# EAGLE design FabDisPendant (EAGLE 7.4.0)
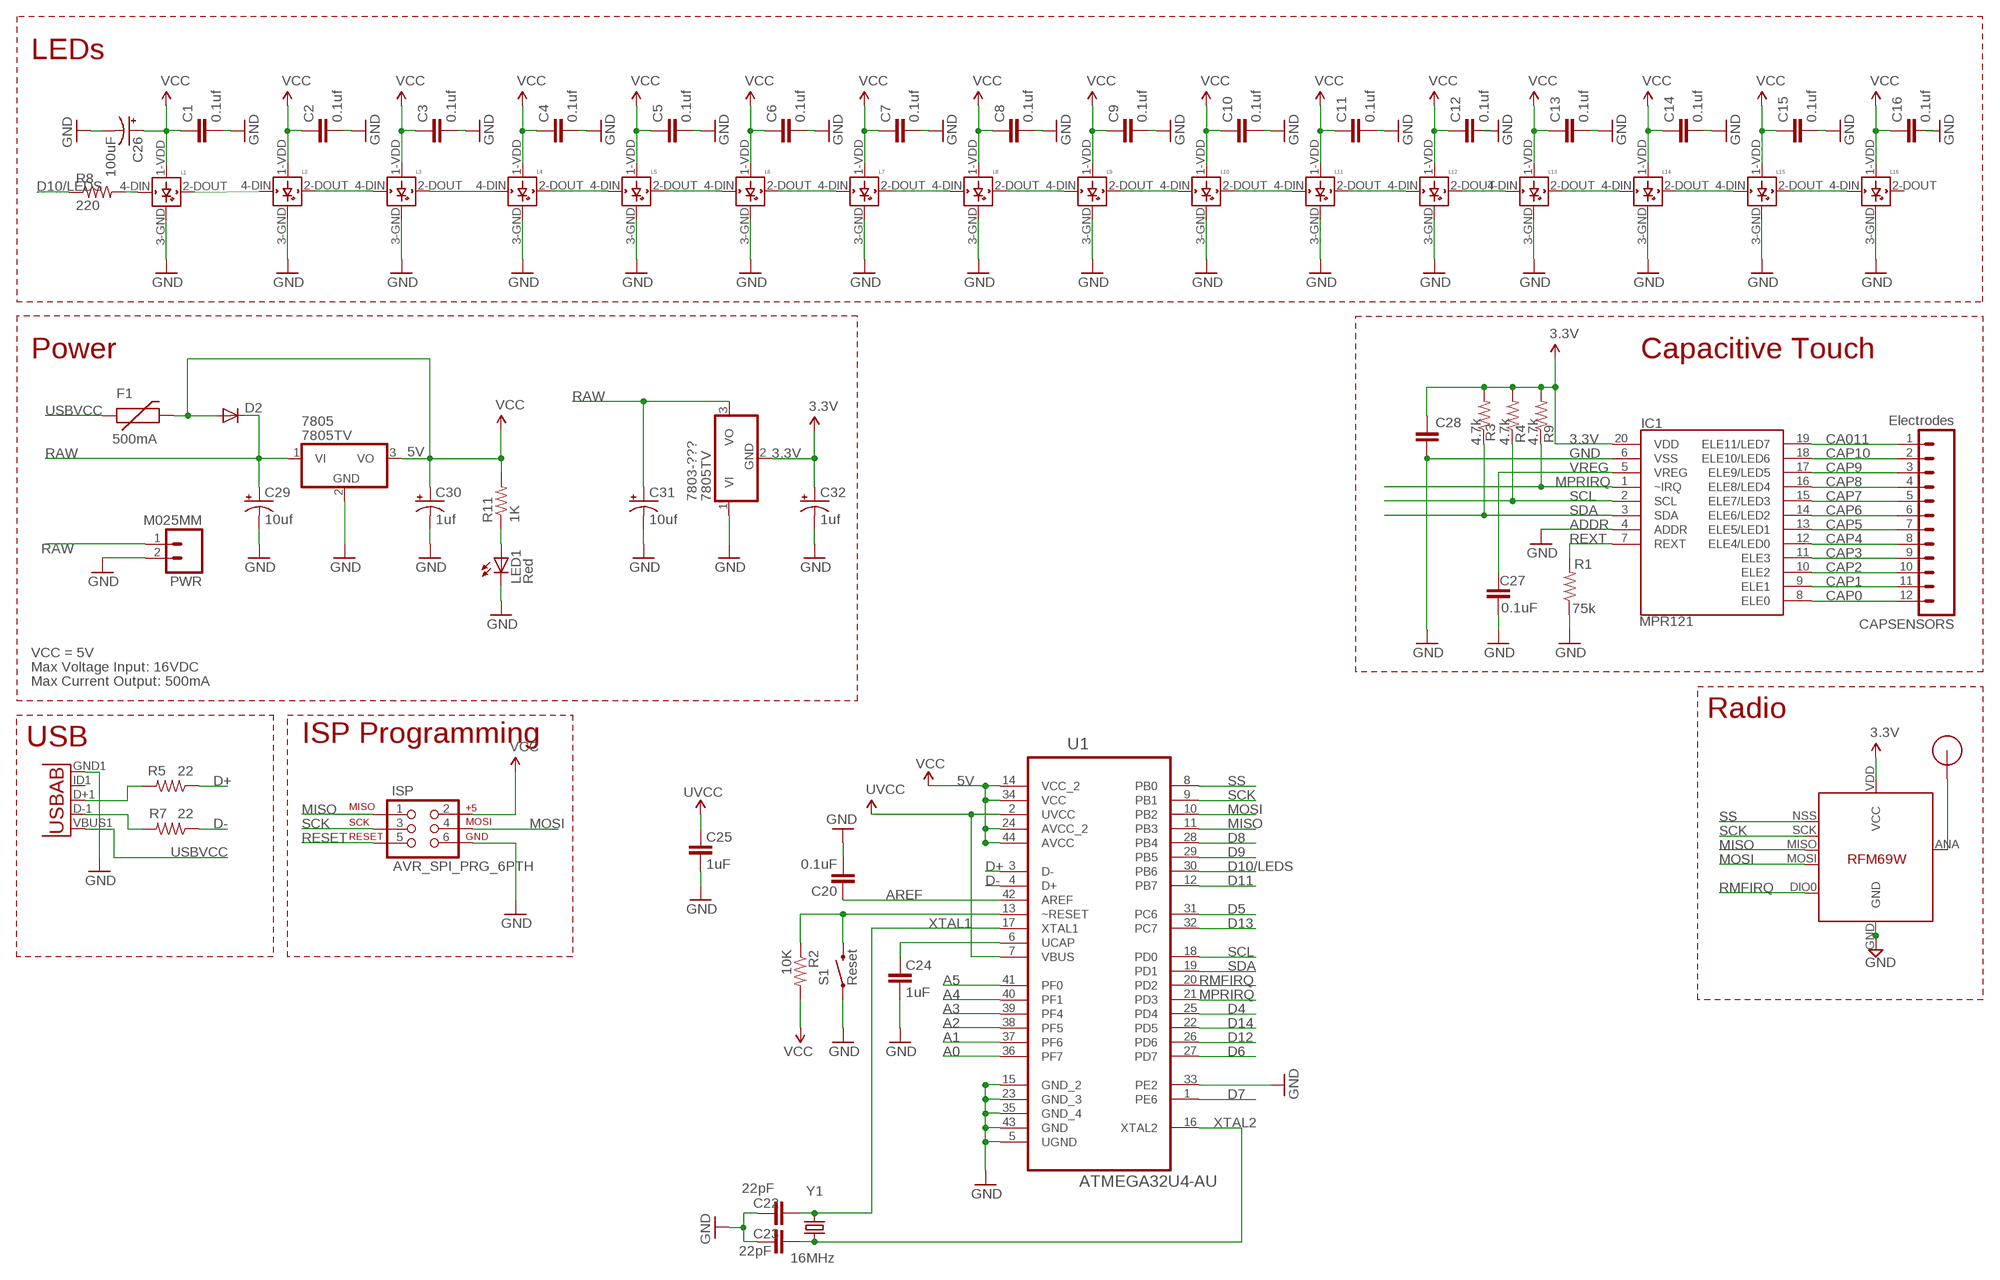
[diagram p0: schematic, sheet 1]

## Parts
7803-???  7805TV  [TO220V]
7805  7805TV  [TO220V]
C1  0.1uf  CAP0603-CAP  [0603-CAP]
C2  0.1uf  CAP0603-CAP  [0603-CAP]
C3  0.1uf  CAP0603-CAP  [0603-CAP]
C4  0.1uf  CAP0603-CAP  [0603-CAP]
C5  0.1uf  CAP0603-CAP  [0603-CAP]
C6  0.1uf  CAP0603-CAP  [0603-CAP]
C7  0.1uf  CAP0603-CAP  [0603-CAP]
C8  0.1uf  CAP0603-CAP  [0603-CAP]
C9  0.1uf  CAP0603-CAP  [0603-CAP]
C10  0.1uf  CAP0603-CAP  [0603-CAP]
C11  0.1uf  CAP0603-CAP  [0603-CAP]
C12  0.1uf  CAP0603-CAP  [0603-CAP]
C13  0.1uf  CAP0603-CAP  [0603-CAP]
C14  0.1uf  CAP0603-CAP  [0603-CAP]
C15  0.1uf  CAP0603-CAP  [0603-CAP]
C16  0.1uf  CAP0603-CAP  [0603-CAP]
C20  0.1uF  CAP0603-CAP  [0603-CAP]
C22  22pF  CAP0603-CAP  [0603-CAP]
C23  22pF  CAP0603-CAP  [0603-CAP]
C24  1uF  CAP0603-CAP  [0603-CAP]
C25  1uF  CAP0603-CAP  [0603-CAP]
C26  100uF  100UF-63V-20%(ELECT)  [NIC_10X10.5_CAP]
C27  0.1uF  CAP0603-CAP  [0603-CAP]
C28  0.1uF  CAP0603-CAP  [0603-CAP]
C29  10uf  CAP_POLPTH2  [CPOL-RADIAL-10UF-25V]
C30  1uf  CAP_POLPTH2  [CPOL-RADIAL-10UF-25V]
C31  10uf  CAP_POLPTH2  [CPOL-RADIAL-10UF-25V]
C32  1uf  CAP_POLPTH2  [CPOL-RADIAL-10UF-25V]
CAPSENSORS  Electrodes  M12PTH  [1X12]
D2  DIODESOD  [SOD-323]
F1  500mA  PTCSMD  [PTC-1206]
IC1  MPR121  MPR121V2  [QFN-20-0.4MM-V2]
ISP  AVR_SPI_PRG_6PTH  [2X3]
L1  WS2812B  [WS2812B]
L2  WS2812B  [WS2812B]
L3  WS2812B  [WS2812B]
L4  WS2812B  [WS2812B]
L5  WS2812B  [WS2812B]
L6  WS2812B  [WS2812B]
L7  WS2812B  [WS2812B]
L8  WS2812B  [WS2812B]
L9  WS2812B  [WS2812B]
L10  WS2812B  [WS2812B]
L11  WS2812B  [WS2812B]
L12  WS2812B  [WS2812B]
L13  WS2812B  [WS2812B]
L14  WS2812B  [WS2812B]
L15  WS2812B  [WS2812B]
L16  WS2812B  [WS2812B]
LED1  Red  LED0603  [LED-0603]
PWR  M025MM  [SCREWTERMINAL-5MM-2]
R1  75k  RESISTOR0603-RES  [0603-RES]
R2  10K  RESISTOR0603-RES  [0603-RES]
R3  4.7k  RESISTOR0603-RES  [0603-RES]
R4  4.7k  RESISTOR0603-RES  [0603-RES]
R5  22  RESISTOR0603-RES  [0603-RES]
R7  22  RESISTOR0603-RES  [0603-RES]
R8  220  220OHM-1/10W-1%(0603)  [0603-RES@1]
R9  4.7k  RESISTOR0603-RES  [0603-RES]
R11  1K  RESISTOR0603-RES  [0603-RES]
RMF69  RFM69  [RFM69W-MINPADS]
S1  Reset  SWITCH-MOMENTARY-2SMD  [TACTILE_SWITCH_SMD]
U1  ATMEGA32U4-AU  [QFP80P1200X1200X120-44N]
U$1  RFM12B_ANTENNA  [RFM12B-ANTENNA]
X2  USB-ABIN&OUT  [USB-AB-MICRO-SMD-V03-IN&OUT]
Y1  16MHz  CRYSTAL5X3  [CRYSTAL-SMD-5X3]

## Nets
3.3V: 7803-???.2(GND) C28.1 C32.1(+) IC1.20(VDD) R3.2 R4.2 R9.2 RMF69.VDD(VCC)
5V: 7805.3(VO) C1.1 C2.1 C3.1 C4.1 C5.1 C6.1 C7.1 C8.1 C9.1 C10.1 C11.1 C12.1 C13.1 C14.1 C15.1 C16.1 C26.+ C30.1(+) D2.2(A) F1.2 ISP.2 L1.1-VDD(VDD) L2.1-VDD(VDD) L3.1-VDD(VDD) L4.1-VDD(VDD) L5.1-VDD(VDD) L6.1-VDD(VDD) L7.1-VDD(VDD) L8.1-VDD(VDD) L9.1-VDD(VDD) L10.1-VDD(VDD) L11.1-VDD(VDD) L12.1-VDD(VDD) L13.1-VDD(VDD) L14.1-VDD(VDD) L15.1-VDD(VDD) L16.1-VDD(VDD) R2.2 R11.2 U1.14(VCC_2) U1.24(AVCC_2) U1.34(VCC) U1.44(AVCC) ; supply symbol labelled VCC
A0: U1.36(PF7)
A1: U1.37(PF6)
A2: U1.38(PF5)
A3: U1.39(PF4)
A4: U1.40(PF1)
A5: U1.41(PF0)
ADDR: IC1.4(ADDR) ; supply symbol labelled GND
AREF: C20.2 U1.42(AREF)
CA011: CAPSENSORS.1 IC1.19(ELE11/LED7)
CAP0: CAPSENSORS.12 IC1.8(ELE0)
CAP1: CAPSENSORS.11 IC1.9(ELE1)
CAP2: CAPSENSORS.10 IC1.10(ELE2)
CAP3: CAPSENSORS.9 IC1.11(ELE3)
CAP4: CAPSENSORS.8 IC1.12(ELE4/LED0)
CAP5: CAPSENSORS.7 IC1.13(ELE5/LED1)
CAP6: CAPSENSORS.6 IC1.14(ELE6/LED2)
CAP7: CAPSENSORS.5 IC1.15(ELE7/LED3)
CAP8: CAPSENSORS.4 IC1.16(ELE8/LED4)
CAP9: CAPSENSORS.3 IC1.17(ELE9/LED5)
CAP10: CAPSENSORS.2 IC1.18(ELE10/LED6)
D4: U1.25(PD4)
D5: U1.31(PC6)
D6: U1.27(PD7)
D7: U1.1(PE6)
D8: U1.28(PB4)
D9: U1.29(PB5)
D10/LEDS: R8.1 U1.30(PB6)
D11: U1.12(PB7)
D12: U1.26(PD6)
D13: U1.32(PC7)
D14: U1.22(PD5)
D+: R5.1 U1.3(D-)
D-: R7.1 U1.4(D+)
GND: 7803-???.1(VI) 7805.2(GND) C1.2 C2.2 C3.2 C4.2 C5.2 C6.2 C7.2 C8.2 C9.2 C10.2 C11.2 C12.2 C13.2 C14.2 C15.2 C16.2 C20.1 C22.2 C23.2 C24.1 C25.1 C26.- C27.2 C28.2 C29.2(-) C30.2(-) C31.2(-) C32.2(-) IC1.6(VSS) ISP.6 L1.3-GND(GND) L2.3-GND(GND) L3.3-GND(GND) L4.3-GND(GND) L5.3-GND(GND) L6.3-GND(GND) L7.3-GND(GND) L8.3-GND(GND) L9.3-GND(GND) L10.3-GND(GND) L11.3-GND(GND) L12.3-GND(GND) L13.3-GND(GND) L14.3-GND(GND) L15.3-GND(GND) L16.3-GND(GND) LED1.C PWR.2 R1.1 RMF69.GND S1.1 U1.5(UGND) U1.15(GND_2) U1.23(GND_3) U1.33(PE2) U1.35(GND_4) U1.43(GND) X2.GND1(GND)
MISO: ISP.1 RMF69.MISO U1.11(PB3)
MOSI: ISP.4 RMF69.MOSI U1.10(PB2)
MPRIRQ: IC1.1(~IRQ) R9.1 U1.21(PD3)
N$1: L1.4-DIN(DIN) R8.2
N$2: L1.2-DOUT(DOUT) L2.4-DIN(DIN)
N$3: L2.2-DOUT(DOUT) L3.4-DIN(DIN)
N$4: L3.2-DOUT(DOUT) L4.4-DIN(DIN)
N$5: L5.2-DOUT(DOUT) L6.4-DIN(DIN)
N$6: L6.2-DOUT(DOUT) L7.4-DIN(DIN)
N$7: L7.2-DOUT(DOUT) L8.4-DIN(DIN)
N$8: L9.2-DOUT(DOUT) L10.4-DIN(DIN)
N$9: L10.2-DOUT(DOUT) L11.4-DIN(DIN)
N$10: L11.2-DOUT(DOUT) L12.4-DIN(DIN)
N$11: L8.2-DOUT(DOUT) L9.4-DIN(DIN)
N$12: L4.2-DOUT(DOUT) L5.4-DIN(DIN)
N$13: L13.2-DOUT(DOUT) L14.4-DIN(DIN)
N$14: L14.2-DOUT(DOUT) L15.4-DIN(DIN)
N$15: L15.2-DOUT(DOUT) L16.4-DIN(DIN)
N$16: L12.2-DOUT(DOUT) L13.4-DIN(DIN)
N$20: R7.2 X2.D-1(D-)
N$21: R5.2 X2.D+1(D+)
N$25: RMF69.ANA(ANT) U$1.P$1
N$38: LED1.A R11.1
N$55: C24.2 U1.6(UCAP)
RAW [vcc]: 7803-???.3(VO) 7805.1(VI) C29.1(+) C31.1(+) D2.1(C) PWR.1
RESET: ISP.5 R2.1 S1.3 U1.13(~RESET)
REXT: IC1.7(REXT) R1.2
RMFIRQ: RMF69.DIO0 U1.20(PD2)
SCK: ISP.3 RMF69.SCK U1.9(PB1)
SCL: IC1.2(SCL) R4.1 U1.18(PD0)
SDA: IC1.3(SDA) R3.1 U1.19(PD1)
SS: RMF69.NSS(SEL) U1.8(PB0)
USBVCC: C25.2 F1.1 U1.2(UVCC) U1.7(VBUS) X2.VBUS1(VBUS) ; supply symbol labelled UVCC
VREG: C27.1 IC1.5(VREG)
XTAL1: C22.1 U1.17(XTAL1) Y1.3
XTAL2: C23.1 U1.16(XTAL2) Y1.1
Unconnected: L16.2-DOUT(DOUT) X2.ID1(USBID)

## Notes on the sheet
- LEDs
- Power | Capacitive Touch
- VCC = 5V
- Max Voltage Input: 16VDC
- Max Current Output: 500mA
- Radio
- USB | ISP Programming

## Library data of the parts
7803-??? 7805 = linear:78*: Positive VOLTAGE REGULATOR Source: http://cache.national.com/ds/LM/LM78L05.pdf http://www.fairchildsemi.com/ds/LM/LM7805.pdf
C1-C16 = SparkFun-Capacitors:CAP: Capacitor Standard 0603 ceramic capacitor, and 0.1" leaded capacitor.
C20 C22-C25 C27 C28 = SparkFun:CAP: Capacitor Standard 0603 ceramic capacitor, and 0.1" leaded capacitor.
C26 = SparkFun-Capacitors:100UF-63V-20%(ELECT): CAP-08362 100uF electrolytic SMT 63V 20%; PROD_ID: CAP-08362
C29-C32 = SparkFun-Capacitors:CAP_POL: Capacitor Polarized These are standard SMD and PTH capacitors. Normally 10uF, 47uF, and 100uF in electrolytic and tantalum varieties. Always verify the external diameter of the through hole cap, it varies with capacity, voltage, and manufacturer. The EIA devices should be standard.
CAPSENSORS = SparkFun:M12: Header 12 Standard 12-pin 0.1" header. Use with straight break away headers (SKU : PRT-00116), right angle break away headers (PRT-00553), swiss pins (PRT-00743), machine pins (PRT-00117), and female headers (PRT-00115).
D2 = SparkFun:DIODE: Diode These are standard reverse protection diodes and small signal diodes. SMA package can handle up to about 1A. SOD-323 can handle about 200mA. What the SOD-323 package when ordering, there are some mfgs out there that are 5-pin packages.
F1 = SparkFun:PTC: Resettable Fuse PTC Resettable Fuse. Spark Fun Electronics SKU : COM-08357
IC1 = Testing:MPR121: MPR121 Capacitive Touch Sensor Controller. Variant "V2" was created using an image import of the bottom of the IC. It matches metal to metal.
ISP = SparkFun-Connectors:AVR_SPI_PRG_6: AVR ISP 6 Pin This is the reduced ISP connector for AVR programming. Common on Arduino. This footprint will take up less PCB space and can be used with a 10-pin to 6-pin adapter such as SKU: BOB-08508
L1-L16 = adafruit:WS2812B
LED1 = SparkFun:LED: LEDs Standard schematic elements and footprints for 5mm, 3mm, 1206, and 0603 sized LEDs. 5mm - Spark Fun Electronics SKU : COM-00529 (and others)
PWR = SparkFun-Connectors:M02: Standard 2-pin 0.1" header. Use with - straight break away headers ( PRT-00116) - right angle break away headers (PRT-00553) - swiss pins (PRT-00743) - machine pins (PRT-00117) - female headers (PRT-00115) Molex polarized connector foot print use with: PRT-08233 with associated crimp pins and housings. 2.54_SCREWTERM for use with PRT-10571. 3.5mm Screw Terminal footprints for PRT-08084 5mm Screw Terminal footprints for use with PRT-08433
R1-R5 R7 R9 R11 = SparkFun:RESISTOR: Resistor Basic schematic elements and footprints for 0603, 1206, and PTH 1/10th watt (small) resistors.
R8 = SparkFun-Resistors:220OHM-1/10W-1%(0603): RES-07861; PROD_ID: RES-07861
RMF69 = LowPowerLab:RFM69
S1 = SparkFun:SWITCH-MOMENTARY-2
U1 = Atmel_By_element14_Batch_1-00:ATMEGA32U4-AU: 8-bit Microcontroller with ISP Flash and USB Controller; MPN: ATMEGA32U4-AU; OC_FARNELL: 1748525; OC_NEWARK: 26R5633; PACKAGE: TQFP-44; SUPPLIER: Atmel
U$1 = LowPowerLab:RFM12B_ANTENNA
X2 = Testing:USB-AB: This is a USB AB connector that is compatible with USB OTG. i.e. this connector can serve as a host or device
Y1 = SparkFun:CRYSTAL: Crystals Various standard crystals. Proven footprints. Spark Fun Electronics SKU : COM-00534

## Net classes
0 default: width 0.203 mm

## Board
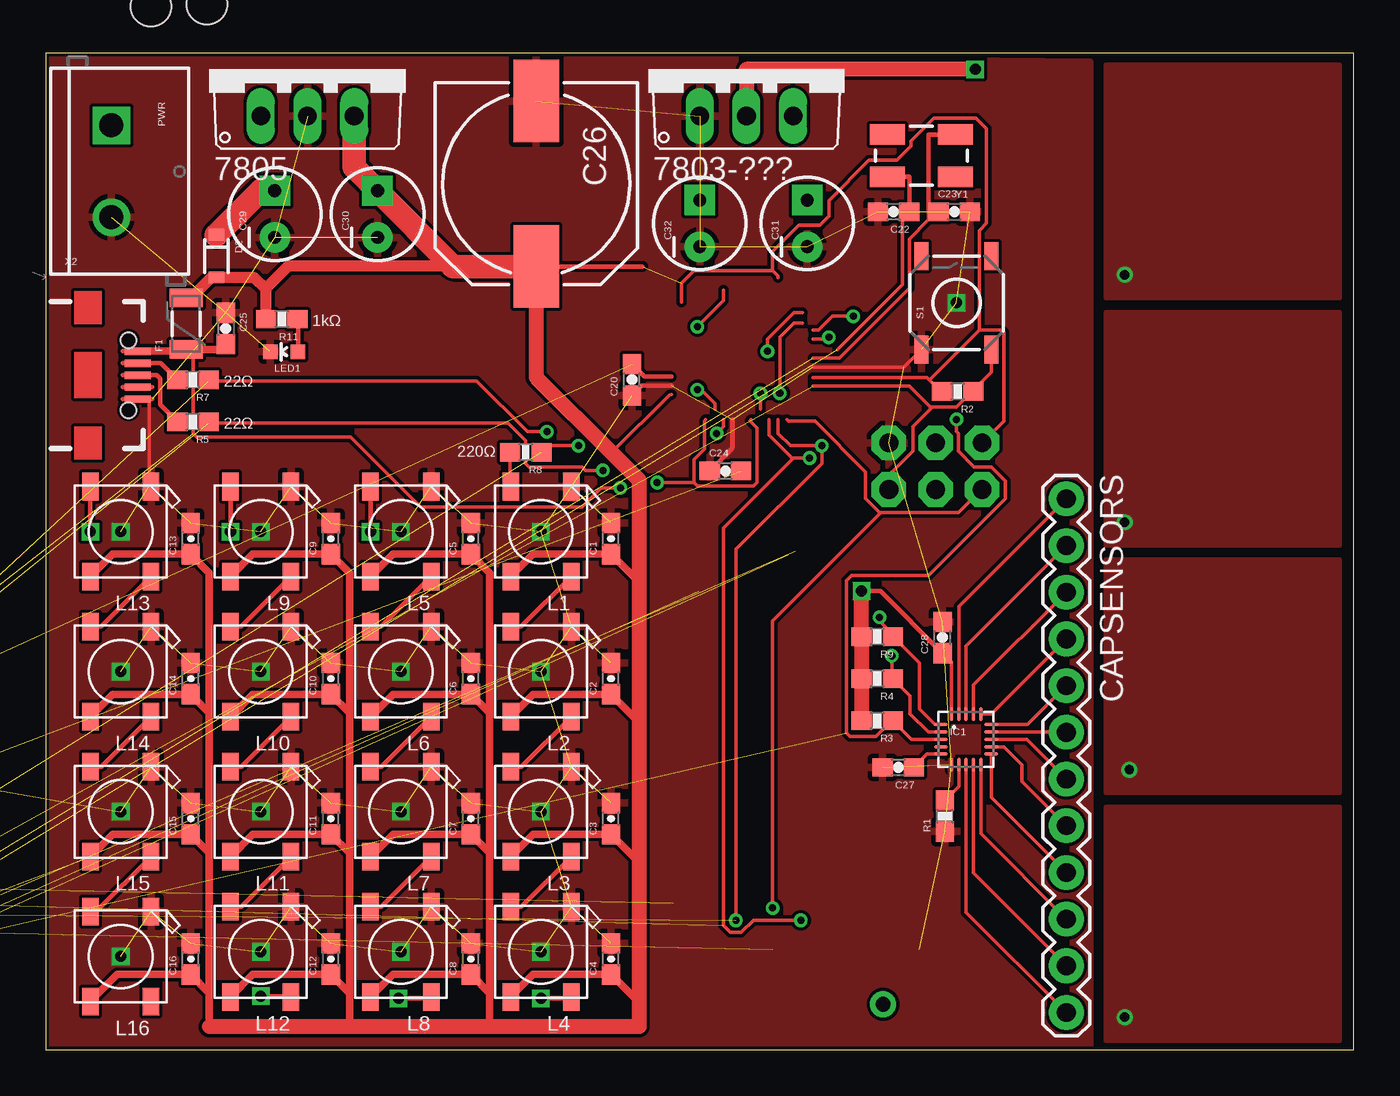
[diagram p1: board, top side]
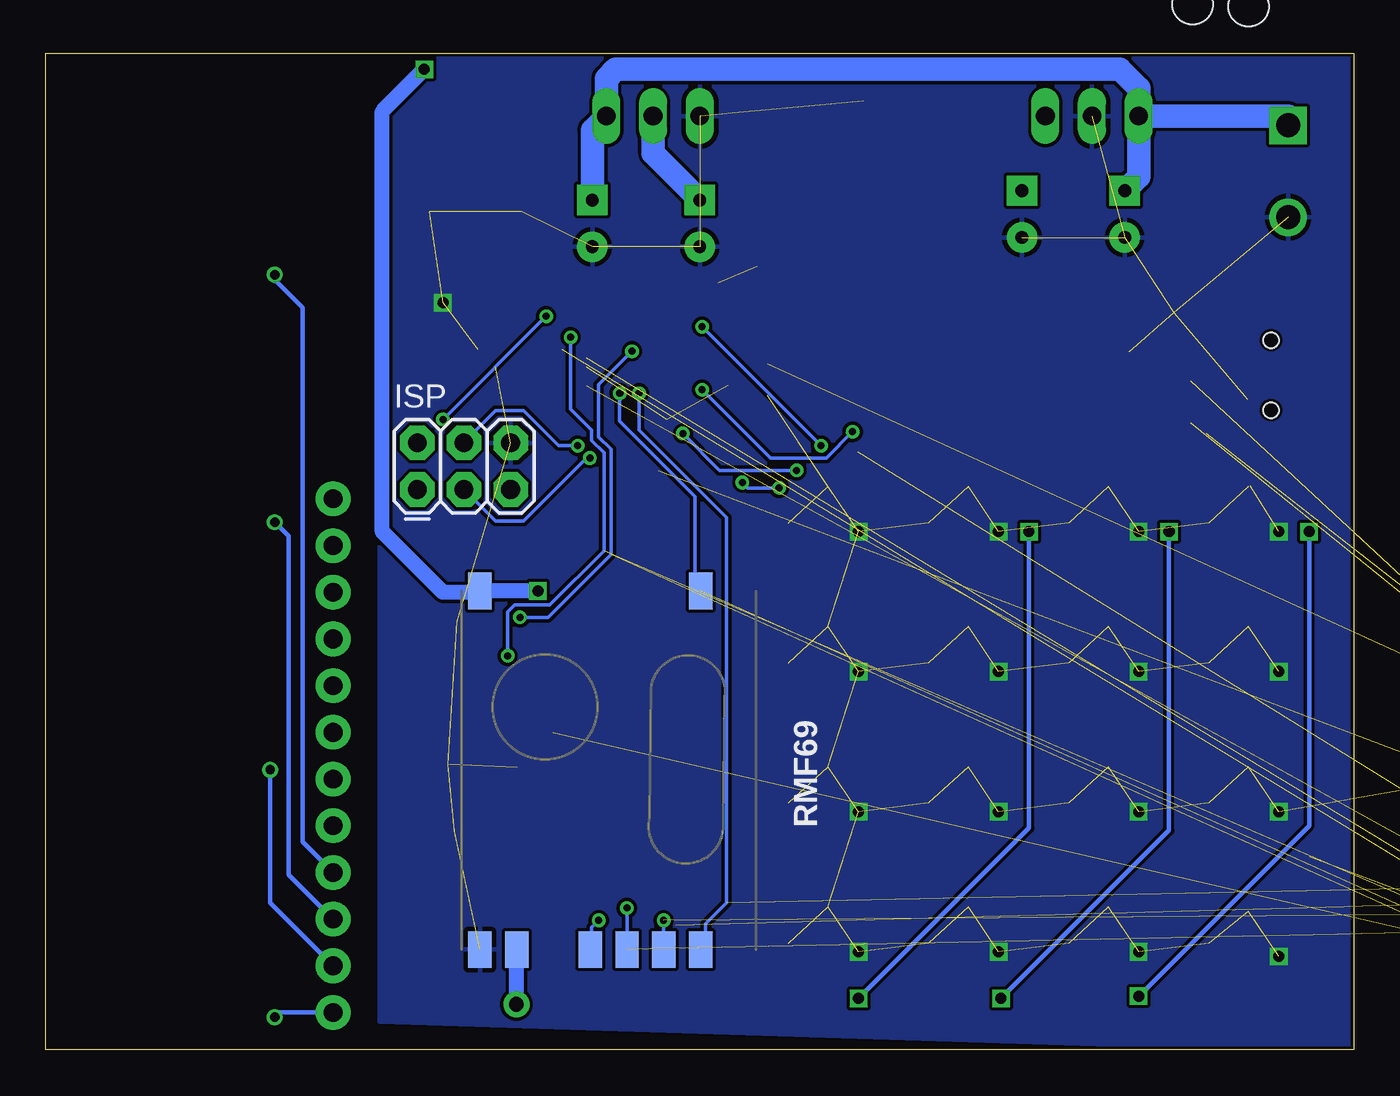
[diagram p2: board, bottom side, seen from below]

Size 71.12 x 54.22 mm. Coordinates in mm from the lower left corner, seen from the top.
Outline: 0,0 71.12,0 71.12,54.22 0,54.22 0,0
Copper layers (1*16): Top 0.035mm / dielectric 1.5mm / Bottom 0.035mm
Design rules "SparkFun-2-layer-TIGHT": minimum track width 7mil, minimum drill 15mil, track to track 7mil, track to pad 7mil, pad to pad 7mil, via to via 7mil, smd to smd 7mil, copper to edge 7mil, drill to drill 7mil, minimum pad ring 7mil, minimum via ring 7mil, stop-mask expansion 4mil, vias tented up to drill 20mil, thermal gap 10mil
Holes 2.2 mm at 5.71,56.77 8.76,56.9

### Footprints (pad centres in the part's own frame; a part is rotated, then mirrored left to right if it is on the bottom)
TO220V = drill 1.016 long: 1 -2.54,-2.54; 2 0,-2.54; 3 2.54,-2.54
0603-CAP = smd 1.1 x 1: 1 -0.85,0; 2 0.85,0
NIC_10X10.5_CAP = smd 4.5 x 2.5: + 4.5,0; - -4.5,0
CPOL-RADIAL-10UF-25V = drill 0.7 pad 1.651 square: 1 1.27,0 | drill 0.7 pad 1.651: 2 -1.27,0
1X12 = drill 1.016 pad 1.88: 1 0,0; 2 2.54,0; 3 5.08,0; 4 7.62,0; 5 10.16,0; 6 12.7,0; 7 15.24,0; 8 17.78,0; 9 20.32,0; 10 22.86,0; 11 25.4,0; 12 27.94,0
SOD-323 = smd 0.63 x 0.83: 1 -1.15,0; 2 1.15,0
PTC-1206 = smd 1 x 1.8: 1 -1.4,0; 2 1.4,0
QFN-20-0.4MM-V2 = smd 0.75 x 0.195: 1 -1.367,0.8; 2 -1.367,0.4; 3 -1.367,0; 4 -1.367,-0.4; 5 -1.367,-0.8; 11 1.375,-0.8; 12 1.375,-0.4; 13 1.375,0; 14 1.375,0.4; 15 1.375,0.8 | smd 0.195 x 0.75: 6 -0.795,-1.372; 7 -0.395,-1.372; 8 0.005,-1.372; 9 0.405,-1.372; 10 0.805,-1.372; 16 0.81,1.372; 17 0.41,1.372; 18 0.01,1.372; 19 -0.39,1.372; 20 -0.79,1.372
2X3 = drill 1.016 pad 1.88 octagon: 1 0,0; 2 0,2.54; 3 2.54,0; 4 2.54,2.54; 5 5.08,0; 6 5.08,2.54
WS2812B = smd 1.5 x 0.9: 1-VDD 2.45,-1.65; 2-DOUT 2.45,1.65; 3-GND -2.45,1.65; 4-DIN -2.45,-1.65
LED-0603 = smd 0.8 x 0.8: A 0,-0.75; C 0,0.75
SCREWTERMINAL-5MM-2 = drill 1.3 pad 2.032 square: 1 0,0 | drill 1.3 pad 2.032: 2 5,0
0603-RES = smd 1.1 x 1: 1 -0.85,0; 2 0.85,0
0603-RES@1 = smd 1.1 x 1: 1 -0.85,0; 2 0.85,0
RFM69W-MINPADS = smd 2 x 1.27: ANA 8,-5; DIO0 -11.5,5; GND 8,-7; MISO 8,1; MOSI 8,3; NSS 8,5; SCK 8,-1; VDD -11.5,-7
TACTILE_SWITCH_SMD = smd 1.524 x 0.762: 1 -2.54,1.905; 2 2.54,1.905; 3 -2.54,-1.905; 4 2.54,-1.905
QFP80P1200X1200X120-44N = smd 1.473 x 0.508: 1 -5.74,3.988; 2 -5.74,3.2; 3 -5.74,2.388; 4 -5.74,1.6; 5 -5.74,0.787; 6 -5.74,0; 7 -5.74,-0.787; 8 -5.74,-1.6; 9 -5.74,-2.388; 10 -5.74,-3.2; 11 -5.74,-3.988; 23 5.74,-3.988; 24 5.74,-3.2; 25 5.74,-2.388; 26 5.74,-1.6; 27 5.74,-0.787; 28 5.74,0; 29 5.74,0.787; 30 5.74,1.6; 31 5.74,2.388; 32 5.74,3.2; 33 5.74,3.988 | smd 0.508 x 1.473: 12 -3.988,-5.74; 13 -3.2,-5.74; 14 -2.388,-5.74; 15 -1.6,-5.74; 16 -0.787,-5.74; 17 0,-5.74; 18 0.787,-5.74; 19 1.6,-5.74; 20 2.388,-5.74; 21 3.2,-5.74; 22 3.988,-5.74; 34 3.988,5.74; 35 3.2,5.74; 36 2.388,5.74; 37 1.6,5.74; 38 0.787,5.74; 39 0,5.74; 40 -0.787,5.74; 41 -1.6,5.74; 42 -2.388,5.74; 43 -3.2,5.74; 44 -3.988,5.74
RFM12B-ANTENNA = drill 0.8 pad 1.422: P$1 0,0
USB-AB-MICRO-SMD-V03-IN&OUT = smd 1.4 x 0.4: D+1 2.7,0; D-1 2.7,0.65; GND1 2.7,-1.3; ID1 2.7,-0.65; VBUS1 2.7,1.3 | hole 0.85: 2.2,1.9; 2.2,-1.9
CRYSTAL-SMD-5X3 = smd 1.9 x 1.1: 1 -1.85,-1.15; 2 1.85,-1.15; 3 1.85,1.15; 4 -1.85,1.15

### Placement (x,y rotation side)
7803-???  38.1,53.34 0 top
7805  14.22,53.34 0 top
C1  30.73,27.81 90 top
C2  30.73,20.19 90 top
C3  30.73,12.57 90 top
C4  30.73,4.95 90 top
C5  23.11,27.81 90 top
C6  23.11,20.19 90 top
C7  23.11,12.57 90 top
C8  23.11,4.95 90 top
C9  15.49,27.81 90 top
C10  15.49,20.19 90 top
C11  15.49,12.57 90 top
C12  15.49,4.95 90 top
C13  7.87,27.81 90 top
C14  7.87,20.19 90 top
C15  7.87,12.57 90 top
C16  7.87,4.95 90 top
C20  31.88,36.45 90 top
C22  46.1,45.59 180 top
C23  49.4,45.59 0 top
C24  36.96,31.5 0 top
C25  9.78,39.24 270 top
C26  26.67,47.12 270 top
C27  46.35,15.37 180 top
C28  48.77,22.43 90 top
C29  12.45,45.47 90 top
C30  18.03,45.47 90 top
C31  41.4,44.96 90 top
C32  35.56,44.96 90 top
CAPSENSORS  55.5,29.97 270 top
D2  9.27,43.18 270 top
F1  7.62,39.5 90 top
IC1  50.04,16.89 0 top
ISP  50.93,30.48 0 bottom
L1  26.92,28.19 270 top
L2  26.92,20.57 270 top
L3  26.92,12.95 270 top
L4  26.92,5.33 270 top
L5  19.3,28.19 270 top
L6  19.3,20.57 270 top
L7  19.3,12.95 270 top
L8  19.3,5.33 270 top
L9  11.68,28.19 270 top
L10  11.68,20.57 270 top
L11  11.68,12.95 270 top
L12  11.68,5.33 270 top
L13  4.06,28.19 270 top
L14  4.06,20.57 270 top
L15  4.06,12.95 270 top
L16  4.06,5.08 270 top
LED1  12.95,37.97 90 top
PWR  3.56,50.29 270 top
R1  48.9,12.73 90 top
R2  49.59,35.81 180 top
R3  45.21,17.91 180 top
R4  45.21,20.19 180 top
R5  8,34.16 180 top
R7  8,36.45 180 top
R8  26.1,32.51 180 top
R9  45.21,22.48 180 top
R11  12.83,39.75 180 top
RMF69  40.51,13.46 270 bottom
S1  49.53,40.64 90 top
U1  -11.43,10.67 0 top  (outside the outline)
U$1  45.53,2.48 0 top
X2  2.29,36.7 0 top
Y1  47.62,48.64 180 top

### Tracks (layer width: path | path; a pad name or v marks a point on that pad's centre or on a via)
3.3V  (via drill 0.6)
  Top 0.203: IC1.20 49.25,21.1 C28.1
  Top 0.254: C28.1 45.38,24.96 v44.36,24.96
  Top 0.813: R3.2 R4.2 R9.2 v44.36,24.96 | v50.55,53.34 38.1,53.34 7803-???.2
  Bottom 0.813: v50.55,53.34 52.83,51.05 52.83,28.19 49.53,24.89 47.58,24.89 RMF69.VDD v44.36,24.96
  Bottom 1.27: C32.1 38.1,48.77 7803-???.2
5V  (5 unrouted)
  Top 0.203: 41.72,36.58 47.91,36.58 48.05,36.43 | 48.05,36.43 48.67,35.81 R2.2 | 50.77,39.15 48.05,36.43 | 50.77,39.15 52.01,39.15 52.1,39.05 52.1,34.2 ISP.2 | 30.77,32.48 33.91,35.62 34.02,35.63 | 39.81,42.01 39.81,42.1 39.53,42.39 | 39.53,42.39 35.24,42.39 34.58,41.72 34.58,40.67 | 50.77,39.15 50.77,44.58 51.15,44.96 51.15,50.1 50.58,50.67 48.29,50.67 47.05,49.44 47.05,49.15 46.29,48.39 44.77,48.39 42.58,46.2 42.58,45.34 42.1,44.86 40.96,44.86 39.53,43.43 39.53,42.39
  Top 0.254: 32.46,42.62 C26.+
  Top 0.406: 32.26,10.2 C3.1 26.49,11.72 L3.1-VDD | 32.26,2.58 C4.1 26.49,4.1 L4.1-VDD | 32.26,17.82 C2.1 26.49,19.34 L2.1-VDD | 32.26,25.44 C1.1 26.49,26.96 L1.1-VDD | L5.1-VDD 18.87,26.96 C5.1 24.13,25.95 24.13,18.33 | L6.1-VDD 18.87,19.34 C6.1 24.13,18.33 | L7.1-VDD 18.87,11.72 C7.1 24.13,10.71 | L8.1-VDD 18.87,4.1 C8.1 24.13,3.09 | L9.1-VDD 11.25,26.96 C9.1 16.51,25.95 16.51,18.33 | L10.1-VDD 11.25,19.34 C10.1 16.51,18.33 | L11.1-VDD 11.25,11.72 C11.1 16.51,10.71 | L12.1-VDD 11.25,4.1 C12.1 16.51,3.09 | L13.1-VDD 3.63,26.96 C13.1 8.89,25.95 8.89,18.33 | L14.1-VDD 3.63,19.34 C14.1 8.89,18.33 | L15.1-VDD 3.63,11.72 C15.1 8.89,10.71 | L16.1-VDD 3.89,4.1 C16.1 8.89,3.09 | 24.13,3.09 24.13,1.27 | 24.13,10.71 24.13,3.09 | 24.13,18.33 24.13,10.71 | 16.51,3.09 16.51,1.27 | 16.51,10.71 16.51,3.09 | 16.51,18.33 16.51,10.71 | 8.89,3.09 8.89,1.27 | 8.89,10.71 8.89,3.09 | 8.89,18.33 8.89,10.71 | 9.02,42.03 D2.2
  Top 0.61: 22.1,42.67 13.21,42.67 11.94,41.4 | 9.02,42.03 7.88,40.9 | D2.2 11.31,42.03 11.94,41.4 | 11.94,41.4 11.94,39.79 R11.2
  Top 0.813: 8.89,1.27 16.51,1.27 24.13,1.27 32.26,1.27 32.26,2.58 32.26,10.2 32.26,17.82 32.26,25.44 32.26,30.99 30.77,32.48 26.67,36.58 C26.+ | 7.88,40.9 F1.2
  Top 1.27: 7805.3 16.76,48.01 C30.1 22.1,42.67 22.15,42.62 C26.+
AREF  (1 unrouted)
  Top 0.254: 34.02,36.62 32.55,36.62 C20.2
CA011
  Top 0.203: IC1.19 49.65,24.12 CAPSENSORS.1
CAP0  (via drill 0.51)
  Top 0.203: IC1.8 50.04,7.49 CAPSENSORS.12
  Bottom 0.254: 58.67,2.03 v58.67,1.78 58.42,2.03 CAPSENSORS.12
  pour Top: 57.66,0.51 70.36,0.51 70.36,13.21 57.66,13.21
CAP1  (via drill 0.51)
  Top 0.203: IC1.9 50.44,9.63 CAPSENSORS.11
  Bottom 0.254: CAPSENSORS.11 58.93,8 v58.93,15.24
  pour Top: 57.66,13.97 70.36,13.97 70.36,26.67 57.66,26.67
CAP2  (via drill 0.51)
  Top 0.203: IC1.10 50.84,11.77 CAPSENSORS.10
  Bottom 0.254: CAPSENSORS.10 57.91,9.53 57.91,27.94 v58.67,28.7
  pour Top: 57.66,27.43 70.36,27.43 70.36,40.13 57.66,40.13
CAP3  (via drill 0.51)
  Top 0.203: IC1.11 51.41,13.74 CAPSENSORS.9
  Bottom 0.254: CAPSENSORS.9 57.15,11.3 57.15,40.39 58.67,41.91
  Bottom 0.406: 58.67,41.91 v58.67,42.16
  pour Top: 57.66,40.89 70.36,40.89 70.36,53.59 57.66,53.59
CAP4
  Top 0.203: IC1.12 52.09,16.49 53.09,15.49 53.09,14.61 CAPSENSORS.8
CAP5
  Top 0.203: IC1.13 53.34,16.89 CAPSENSORS.7
CAP6
  Top 0.203: IC1.14 55.48,17.29 CAPSENSORS.6
CAP7
  Top 0.203: IC1.15 53.38,17.69 CAPSENSORS.5
CAP8
  Top 0.203: IC1.16 51.41,18.26 CAPSENSORS.4
CAP9
  Top 0.203: IC1.17 50.45,19.84 CAPSENSORS.3
CAP10
  Top 0.203: IC1.18 50.05,21.98 CAPSENSORS.2
D10/LEDS  (via drill 0.38)  (1 unrouted)
  Top 0.203: 36.86,41.34 36.86,40.77 v35.43,39.34 | v28.96,32.86 27.24,32.86 26.96,32.58 R8.1
  Bottom 0.203: v28.96,32.86 v35.43,39.34
D+  (via drill 0.38)  (1 unrouted)
  Top 0.203: v36.48,33.53 36.86,33.91 36.86,34.2 36.86,34.29 | v30.29,31.53 29.34,31.53 29.15,31.72 26.29,31.72 26.1,31.91 26.1,33.15 25.15,34.1 8.86,34.1 R5.1
  Bottom 0.203: v36.48,33.53 34.48,31.53 v30.29,31.53
D-  (via drill 0.38)  (1 unrouted)
  Top 0.203: 36.39,34.86 36.39,35.15 35.62,35.91 v35.43,35.91 | v27.24,33.62 26.19,33.62 23.43,36.39 8.86,36.39 R7.1
  Bottom 0.203: v35.43,35.91 31.72,32.19 28.67,32.19 v27.24,33.62
GND  (via drill 0.6)  (75 unrouted)
  Top 0.203: 41.72,37.15 46.67,37.15 S1.1 | X2.GND1 5.62,35.34 5.62,30.67 L13.3-GND | 50.29,45.72 C23.2
  Top 0.254: 37.35,34.29 37.35,32.74 C24.1 | 34.02,36.13 32.41,36.13 C20.1
  other vias: 26.92,20.57 26.92,12.95 19.3,20.57 19.3,12.95 11.68,20.57 11.68,12.95 4.06,20.57 4.06,12.95 4.06,5.08 11.68,5.33 26.92,5.33 19.3,5.33 49.53,40.64 26.92,28.19 19.3,28.19 11.68,28.19 4.06,28.19
  pour Top: 0.25,54.36 56.77,53.72 56.77,-0.13 0,0
  pour Bottom: 0.13,54.36 52.96,54.99 52.96,1.52 0.13,-0.13
MISO  (via drill 0.38)  (1 unrouted)
  Top 0.203: 45.34,29.24 44.58,30 44.58,31.43 41.81,34.2 40.39,34.2 40.31,34.29 | 45.34,29.24 49.62,29.24 50.86,30.48 ISP.1 | v39.53,7.71 39.53,23.34 45.34,29.15 45.34,29.24
  Bottom 0.203: v39.53,7.71 39.53,5.52 RMF69.MISO
MOSI  (via drill 0.38)  (1 unrouted)
  Top 0.203: 39.82,34.29 39.81,34.2 39.81,33.53 40.48,32.86 v42.2,32.86 42.2,31.91 37.53,27.24 v37.53,7.05
  Bottom 0.203: v42.2,32.86 43.24,32.86 45.15,34.77 46.67,34.77 48.39,33.05 ISP.4 | v37.53,7.05 37.53,5.52 RMF69.MOSI
MPRIRQ  (via drill 0.38)  (1 unrouted)
  Top 0.203: IC1.1 48.35,17.69 47.5,18.54 47.5,21.04 R9.1 46.1,22.57 45.34,23.34 v45.34,23.53 | 41.15,40.1 40.67,40.1 39.24,38.67 v39.24,38.01
  Bottom 0.203: v39.24,38.01 41.05,36.2 41.05,33.34 40.39,32.67 40.39,26.96 43.81,23.53 v45.34,23.53
N$1
  Top 0.203: R8.2 25.24,32.48 25.24,30.67 L1.4-DIN
N$2
  Top 0.254: L1.2-DOUT 25.85,23.02 L2.4-DIN
N$3
  Top 0.254: L2.2-DOUT 25.85,15.4 L3.4-DIN
N$4
  Top 0.254: L3.2-DOUT 25.85,7.78 L4.4-DIN
N$5
  Top 0.254: L5.2-DOUT 18.23,23.02 L6.4-DIN
N$6
  Top 0.254: L6.2-DOUT 18.23,15.4 L7.4-DIN
N$7
  Top 0.254: L7.2-DOUT 18.23,7.78 L8.4-DIN
N$8
  Top 0.254: L9.2-DOUT 10.61,23.02 L10.4-DIN
N$9
  Top 0.254: L10.2-DOUT 10.61,15.4 L11.4-DIN
N$10
  Top 0.254: L11.2-DOUT 10.61,7.78 L12.4-DIN
N$11  (via drill 0.6)
  Top 0.254: L8.2-DOUT 20.86,2.79 v19.18,2.79 | v10.03,28.19 v10.03,28.2 L9.4-DIN
  Bottom 0.254: v19.18,2.79 10.03,11.94 v10.03,28.19
N$12  (via drill 0.6)
  Top 0.254: L4.2-DOUT 28.48,2.79 v26.92,2.79 | v17.65,28.19 v17.65,28.2 L5.4-DIN
  Bottom 0.254: v26.92,2.79 17.65,12.06 v17.65,28.19
N$13
  Top 0.254: L13.2-DOUT 2.99,23.02 L14.4-DIN
N$14
  Top 0.254: L14.2-DOUT 2.99,15.4 L15.4-DIN
N$15
  Top 0.254: L15.2-DOUT 2.74,7.53 L16.4-DIN
N$16  (via drill 0.6)
  Top 0.254: L12.2-DOUT 13.3,2.92 v11.68,2.92 | v2.41,28.19 v2.41,28.2 L13.4-DIN
  Bottom 0.254: v11.68,2.92 2.41,12.19 v2.41,28.19
N$20
  Top 0.254: 5.79,37.35 6.25,37.35 R7.2
N$21
  Top 0.254: 5.79,36.7 6.03,36.7 6.22,36.51 6.22,35.09 R5.2
N$25
  Bottom 0.813: U$1.P$1 45.53,5.45 RMF69.ANA
N$38
  Top 0.254: R11.1 13.7,39.72 LED1.A
N$55  (1 unrouted)
RAW
  Top 1.27: D2.1 11.68,46.74 C29.1
  Bottom 1.27: PWR.1 3.56,50.8 7805.1 | 11.18,50.8 7805.1 | C31.1 41.4,50.04 7803-???.3 40.64,52.83 40.13,53.34 12.7,53.34 11.68,52.32 7805.1 | 7805.1 11.68,47.5 C29.1
RESET  (1 unrouted)
  Top 0.203: 41.72,36.1 46.96,36.1 48.1,34.96 | 48.1,34.96 49.53,34.96 50.39,35.81 R2.1 50.48,35.91 51.44,36.86 S1.3 | ISP.5 45.91,30.48 45.91,31.34 47.15,32.58 47.15,33.91 48.1,34.86 48.1,34.96
REXT
  Top 0.203: IC1.7 49.64,14.32 R1.2
RMFIRQ  (via drill 0.38)  (1 unrouted)
  Top 0.203: 41.15,39.53 40.67,39.53 39.91,38.77 v39.91,35.72
  Bottom 0.203: v39.91,35.72 39.91,34.2 35.81,30.1 35.81,25.34 35.53,25.05 RMF69.DIO0
SCK  (via drill 0.38)  (1 unrouted)
  Top 0.203: 40.58,32.19 39.34,33.43 39.34,34.2 39.33,34.29 | v41.53,32.19 40.58,32.19 | v41.05,7.05 38.48,7.05 37.81,6.38 37.24,6.38 36.86,6.76 36.86,28.38 40.58,32.1 40.58,32.19
  Bottom 0.203: v41.53,32.19 41.72,32.19 45.15,28.77 46.67,28.77 ISP.3 | v41.05,7.05 41.43,6.67 41.43,5.52 RMF69.SCK
SCL  (via drill 0.38)  (1 unrouted)
  Top 0.203: IC1.2 47.99,17.29 46.99,18.29 46.99,19.27 R4.1 46.01,20.19 v46.01,21.43 | 41.72,38.67 42.48,38.67 v42.58,38.77
  Bottom 0.203: v42.58,38.77 42.58,34.86 41.43,33.72 41.43,33.15 40.77,32.48 40.77,27.15 43.72,24.19 45.62,24.19 46.01,23.81 v46.01,21.43
SDA  (via drill 0.38)  (1 unrouted)
  Top 0.203: IC1.3 47.08,16.89 R3.1 46.01,17.91 45.15,17.05 43.72,17.05 43.53,17.24 43.53,25.53 43.81,25.81 48.01,25.81 52.2,30 52.2,30.96 51.44,31.72 50.48,31.72 49.62,32.58 49.62,33.53 49.53,33.62 v49.53,34.29 | 41.72,39.15 42.01,39.15 42.77,39.91 v43.91,39.91
  Bottom 0.203: v49.53,34.29 v43.91,39.91
SS  (via drill 0.38)  (1 unrouted)
  Top 0.203: v38.86,35.72 38.86,34.86
  Bottom 0.203: v38.86,35.72 38.86,33.72 34.1,28.96 34.1,8 35.24,6.86 35.24,5.71 35.43,5.52 RMF69.NSS
USBVCC  (via drill 0.38)  (2 unrouted)
  Top 0.203: 35.24,30.86 35.24,32.1 35.81,32.67 35.81,34.2 35.87,34.29 | 35.24,30.86 35.43,30.67 38.48,30.67 38.67,30.86 38.67,33.81 38.29,34.2 38.34,34.29 | v33.24,30.86 35.24,30.86 | v31.24,30.57 30.19,30.57 29.15,29.53 20.38,29.53 16.57,33.34 8.19,33.34 8,33.53 8,37.91 F1.1
  Top 0.406: 9.78,38.35 C25.2 9.48,38.1 F1.1 7.53,38 X2.VBUS1
  Bottom 0.203: v33.24,30.86 32.96,30.57 v31.24,30.57
VREG
  Top 0.203: IC1.5 47.93,16.09 C27.1
XTAL1  (1 unrouted)
  Top 0.203: 43.05,38.1 46.58,41.62 46.58,45.24 46.86,45.53 C22.1
  Top 0.254: Y1.3 46.95,47.49 C22.1
XTAL2  (1 unrouted)
  Top 0.203: 41.72,37.62 43.15,37.62 46.96,41.43 46.96,44.1 48.01,45.15 48.01,45.62 C23.1
  Top 0.254: Y1.1 48.01,49.79 48.01,45.72 48.55,45.72 C23.1

### Text on the board
tPlace: 1kΩ | 22Ω | 22Ω | 220Ω